# EAGLE schematic gcl (EAGLE 8.0.0)
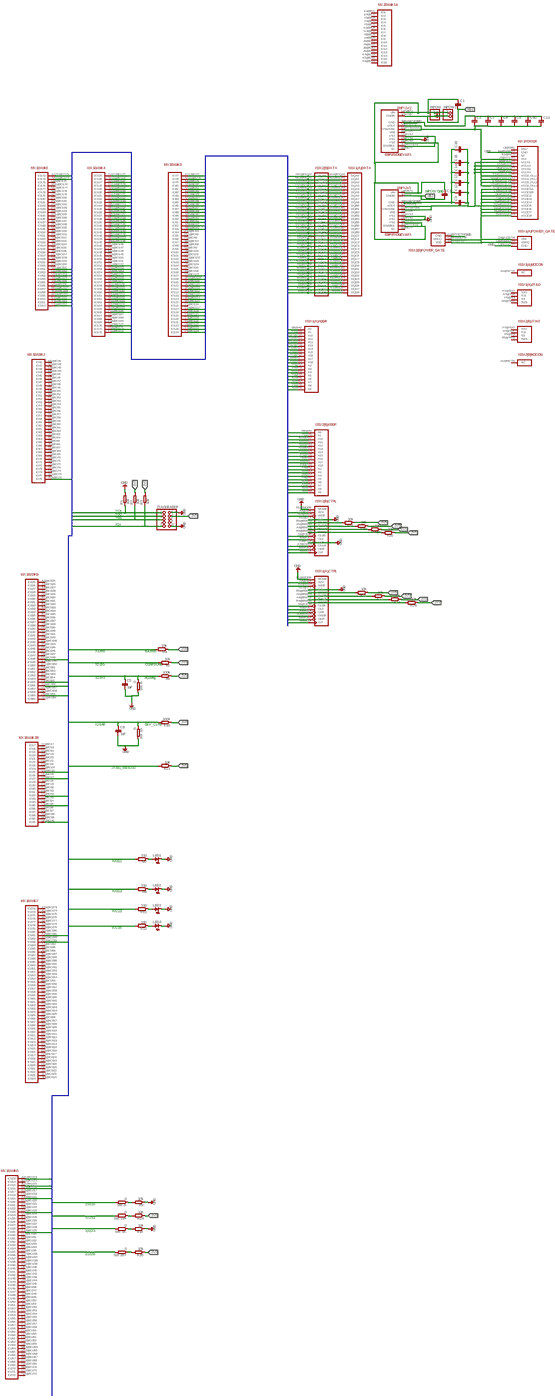
[diagram p0: schematic, sheet 1, overview]
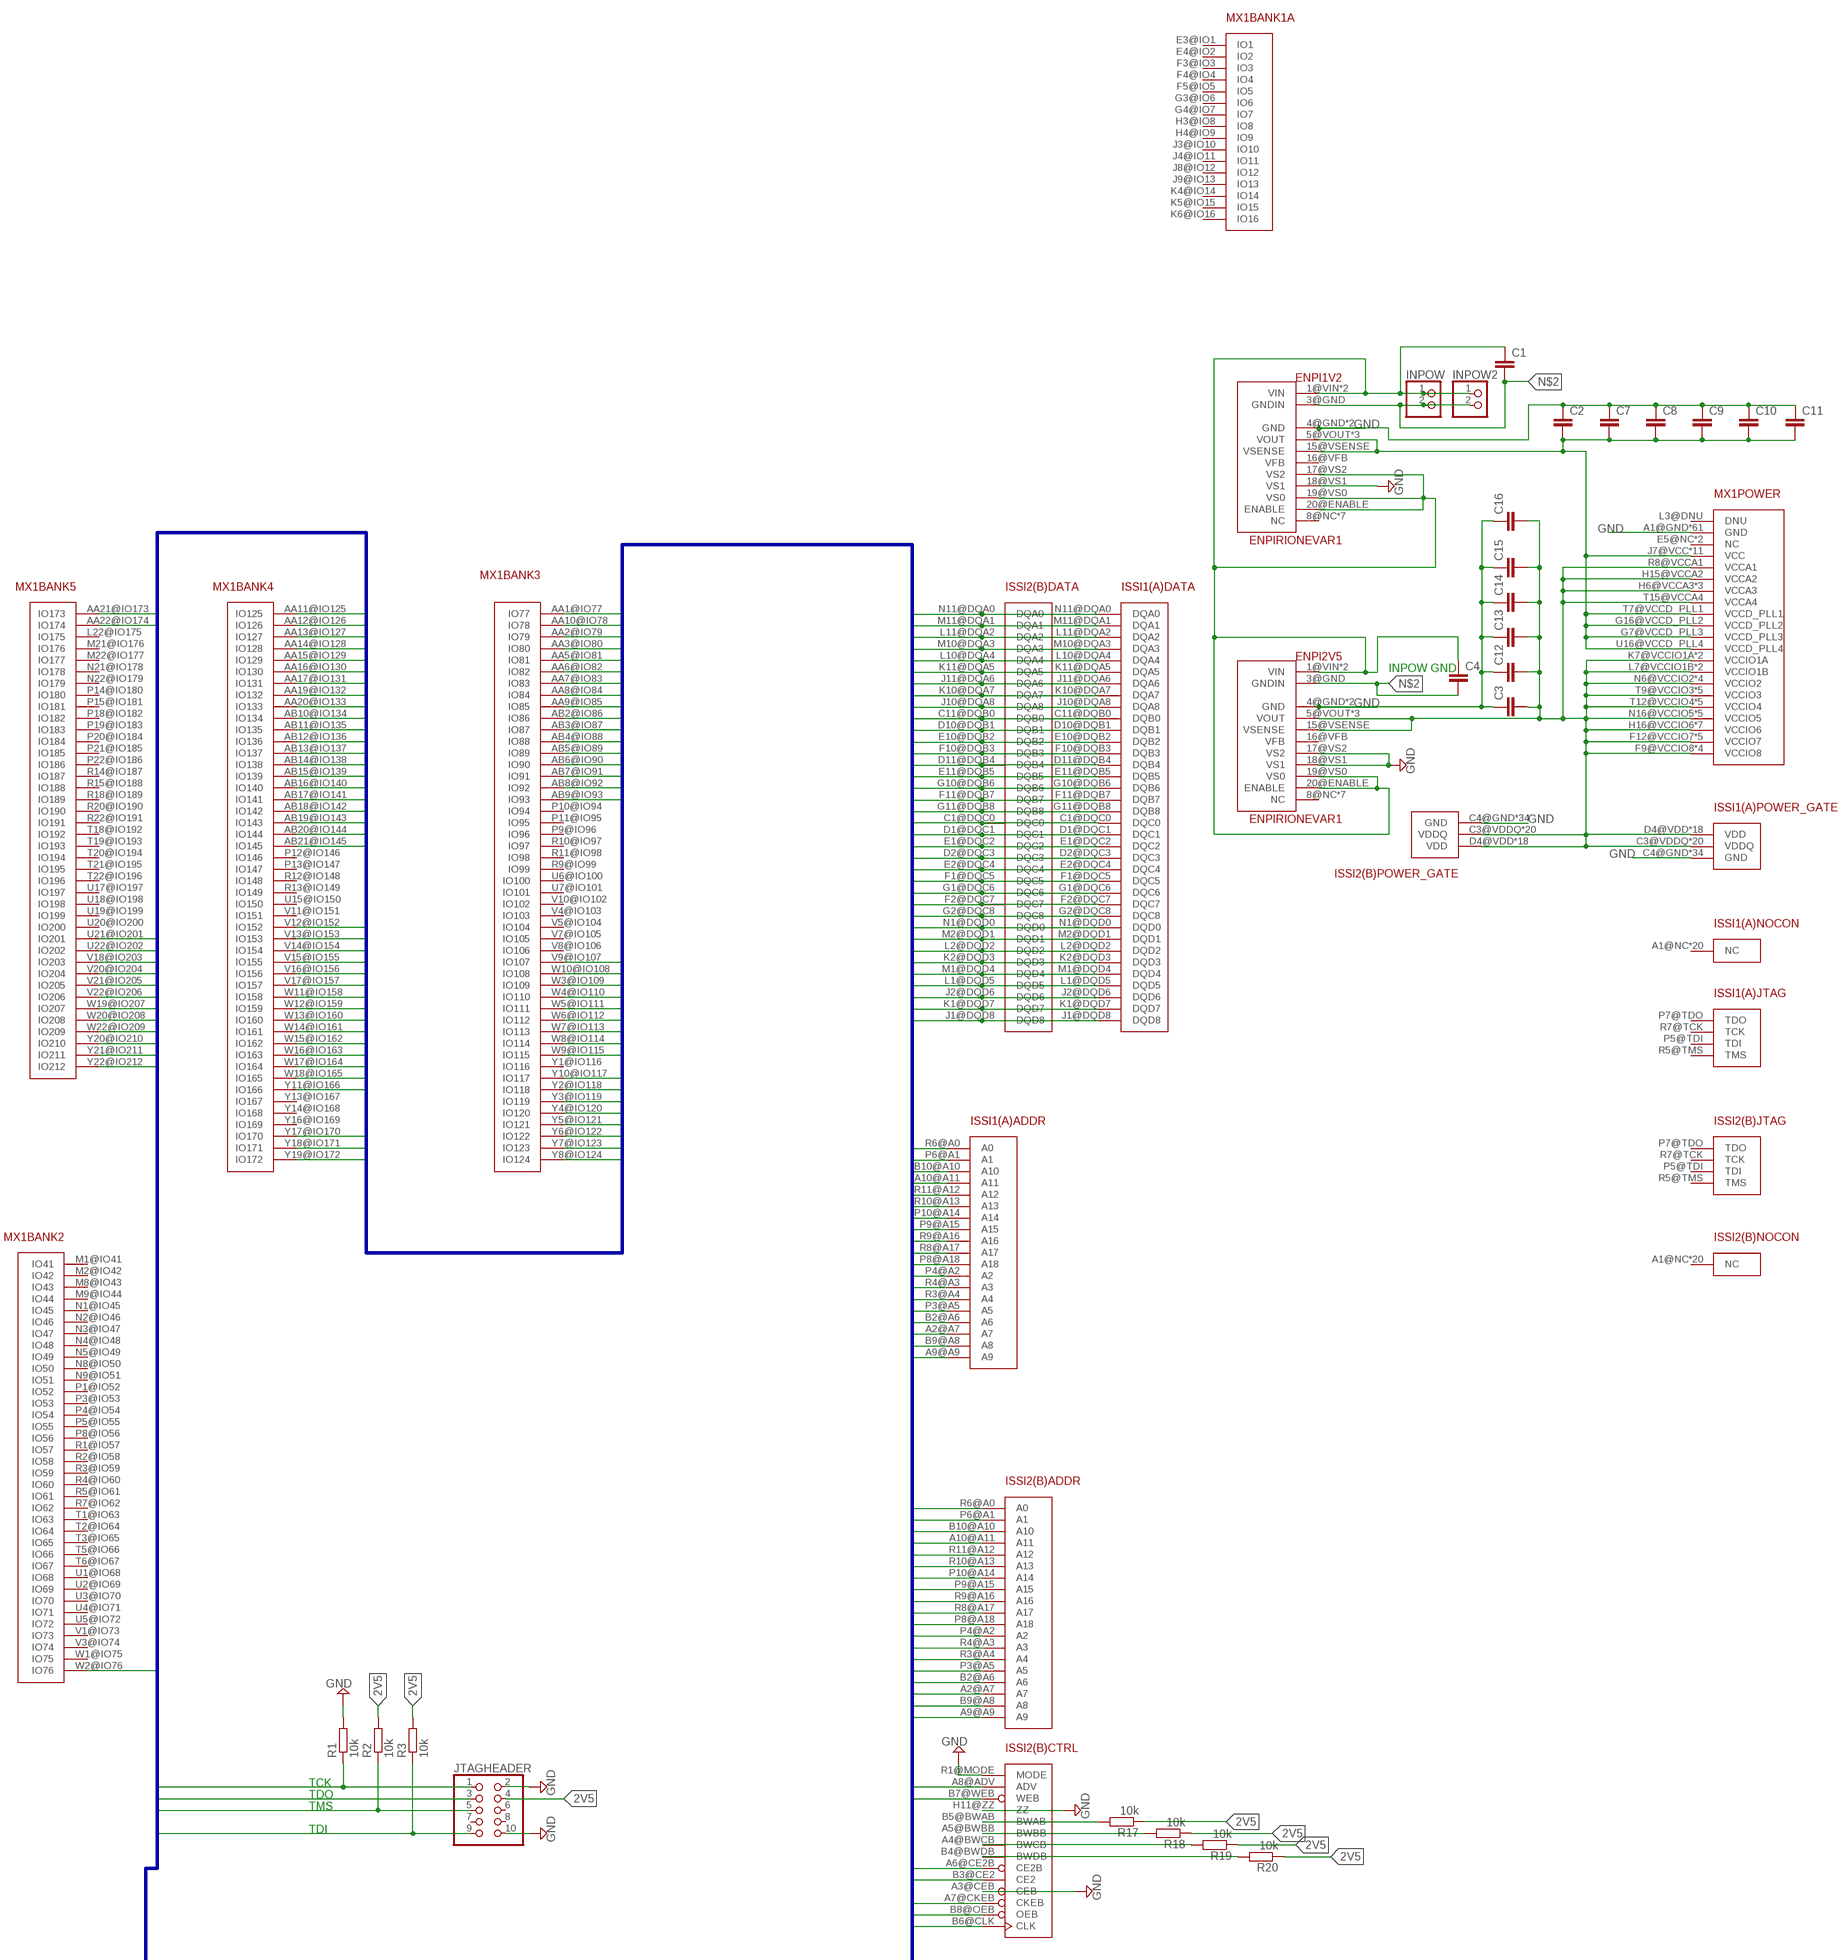
[diagram p1: schematic, sheet 1, part 1 of 4]
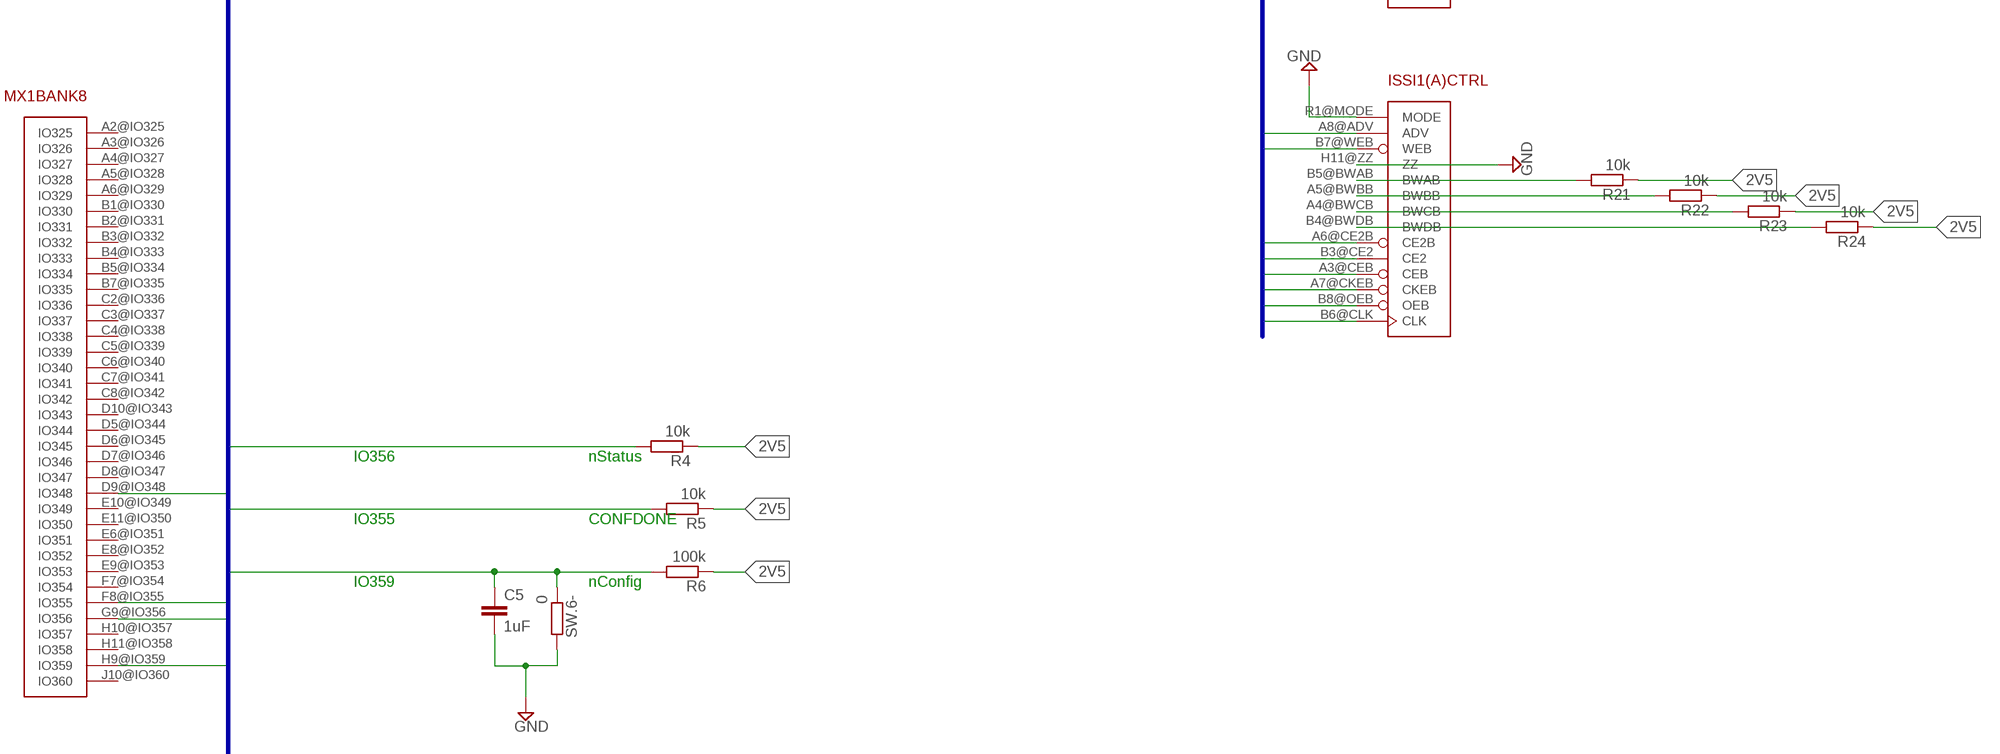
[diagram p2: schematic, sheet 1, part 2 of 4]
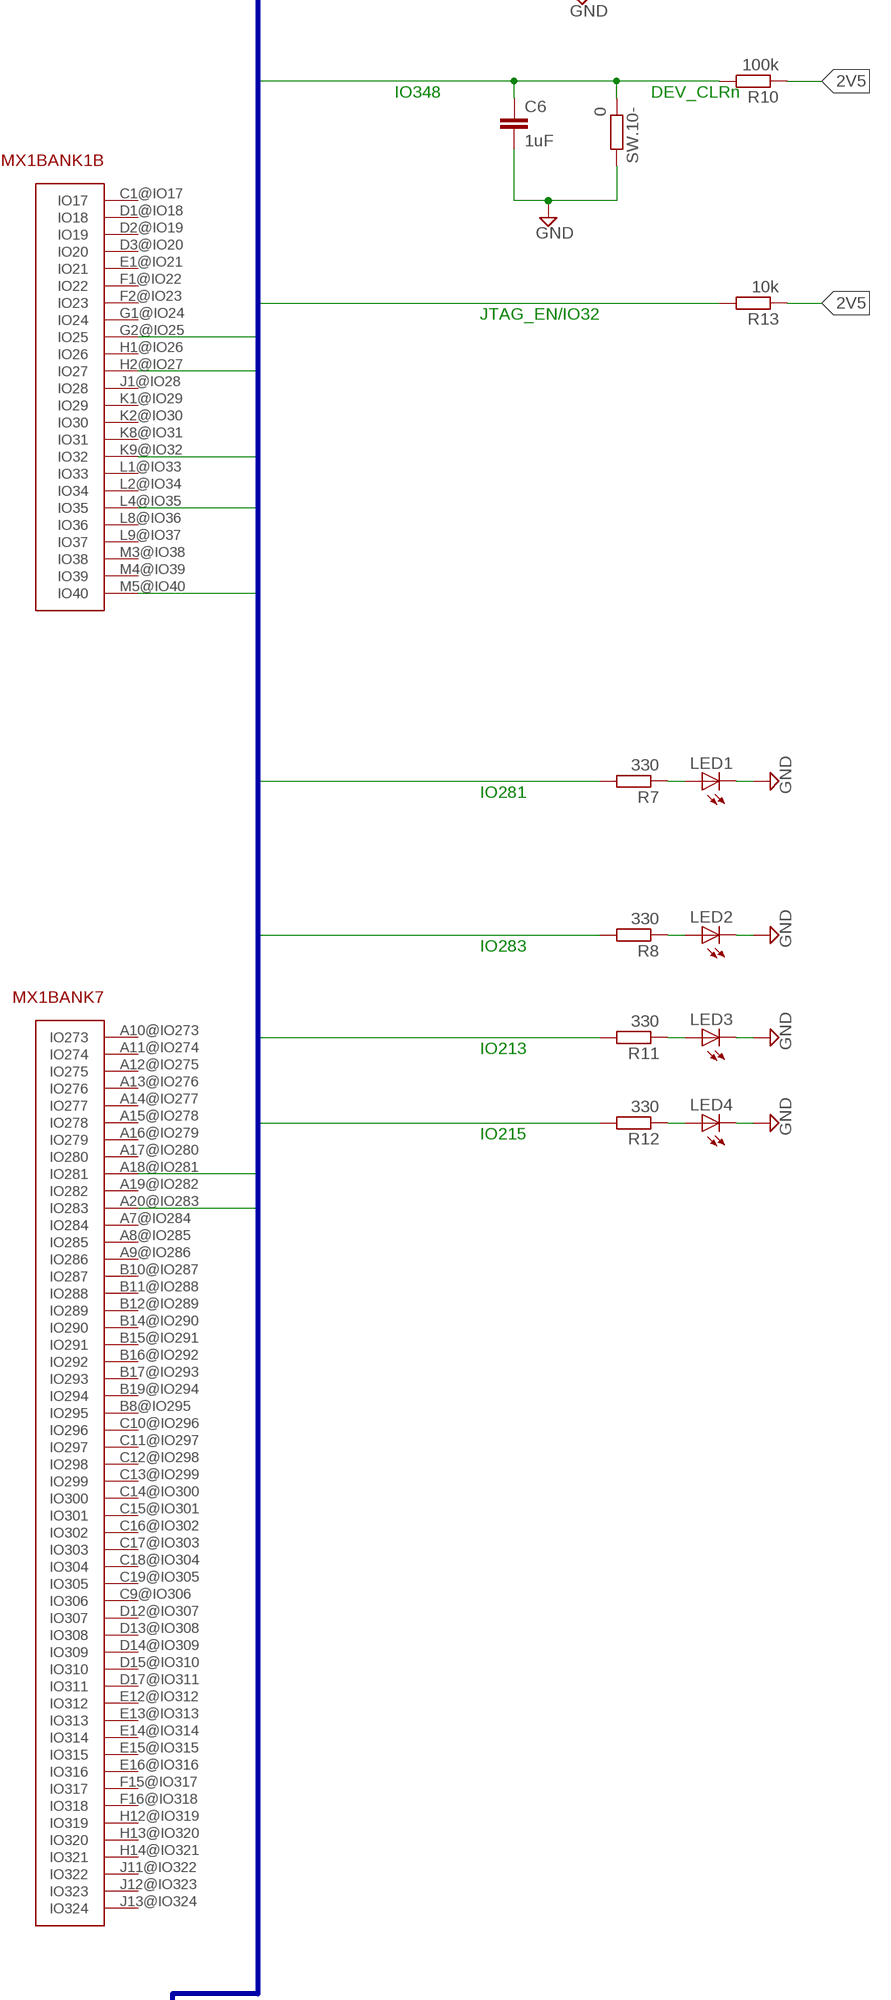
[diagram p3: schematic, sheet 1, part 3 of 4]
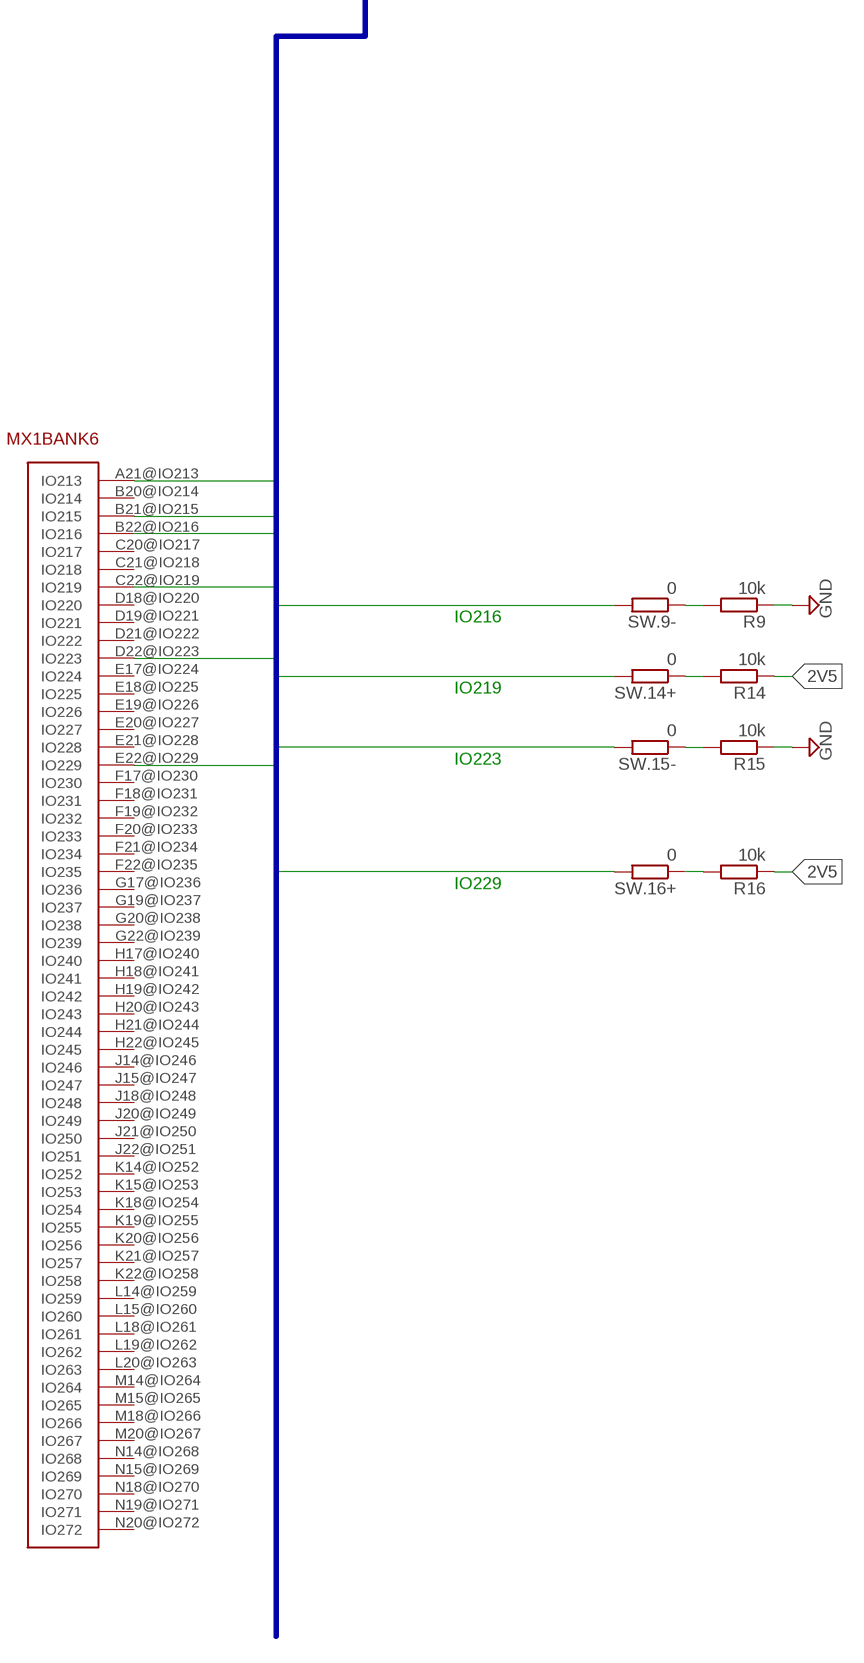
[diagram p4: schematic, sheet 1, part 4 of 4]

## Parts
C1  C-EUC0805  [C0805]
C2  C-EUC0805  [C0805]
C3  C-EUC0805  [C0805]
C4  C-EUC0805  [C0805]
C5  1uF  C-EUC0805  [C0805]
C6  1uF  C-EUC0805  [C0805]
C7  C-EUC0805  [C0805]
C8  C-EUC0805  [C0805]
C9  C-EUC0805  [C0805]
C10  C-EUC0805  [C0805]
C11  C-EUC0805  [C0805]
C12  C-EUC0805  [C0805]
C13  C-EUC0805  [C0805]
C14  C-EUC0805  [C0805]
C15  C-EUC0805  [C0805]
C16  C-EUC0805  [C0805]
ENPI1V2  ENPIRIONEVAR1  [EPAC]
ENPI2V5  ENPIRIONEVAR1  [EPAC]
INPOW  PINHD-1X2  [1X02]
INPOW2  PINHD-1X2  [1X02]
ISSI1(A)  ISSIDEVISSIVAR  [ISSI]
ISSI2(B)  ISSIDEVISSIVAR  [ISSI]
JTAGHEADER  PINHD-2X5  [2X05]
LED1  LEDSML0805  [SML0805]
LED2  LEDSML0805  [SML0805]
LED3  LEDSML0805  [SML0805]
LED4  LEDSML0805  [SML0805]
MX1  MXMXDEVICE  [MXPAC]
R1  10k  R-EU_M0805  [M0805]
R2  10k  R-EU_M0805  [M0805]
R3  10k  R-EU_M0805  [M0805]
R4  10k  R-EU_M0805  [M0805]
R5  10k  R-EU_M0805  [M0805]
R6  100k  R-EU_M0805  [M0805]
R7  330  R-EU_M0805  [M0805]
R8  330  R-EU_M0805  [M0805]
R9  10k  R-EU_M0805  [M0805]
R10  100k  R-EU_M0805  [M0805]
R11  330  R-EU_M0805  [M0805]
R12  330  R-EU_M0805  [M0805]
R13  10k  R-EU_M0805  [M0805]
R14  10k  R-EU_M0805  [M0805]
R15  10k  R-EU_M0805  [M0805]
R16  10k  R-EU_M0805  [M0805]
R17  10k  R-EU_M0805  [M0805]
R18  10k  R-EU_M0805  [M0805]
R19  10k  R-EU_M0805  [M0805]
R20  10k  R-EU_M0805  [M0805]
R21  10k  R-EU_M0805  [M0805]
R22  10k  R-EU_M0805  [M0805]
R23  10k  R-EU_M0805  [M0805]
R24  10k  R-EU_M0805  [M0805]
SW.6-  0  R-EU_M0805  [M0805]
SW.9-  0  R-EU_M0805  [M0805]
SW.10-  0  R-EU_M0805  [M0805]
SW.14+  0  R-EU_M0805  [M0805]
SW.15-  0  R-EU_M0805  [M0805]
SW.16+  0  R-EU_M0805  [M0805]

## Nets
1V2: C2.2 C7.2 C8.2 C9.2 C10.2 C11.2 ENPI1V2.5@VOUT(VOUT) ENPI1V2.6@VOUT(VOUT) ENPI1V2.7@VOUT(VOUT) ENPI1V2.15@VSENSE(VSENSE) MX1.G7@VCCD_PLL3(POWER:VCCD_PLL3) MX1.G16@VCCD_PLL2(POWER:VCCD_PLL2) MX1.J7@VCC(POWER:VCC) MX1.K11@VCC(POWER:VCC) MX1.K13@VCC(POWER:VCC) MX1.L10@VCC(POWER:VCC) MX1.L11@VCC(POWER:VCC) MX1.L12@VCC(POWER:VCC) MX1.M11@VCC(POWER:VCC) MX1.M12@VCC(POWER:VCC) MX1.M13@VCC(POWER:VCC) MX1.N10@VCC(POWER:VCC) MX1.N12@VCC(POWER:VCC) MX1.T7@VCCD_PLL1(POWER:VCCD_PLL1) MX1.U16@VCCD_PLL4(POWER:VCCD_PLL4)
2V5 [sup]: C3.2 C12.2 C13.2 C14.2 C15.2 C16.2 ENPI2V5.5@VOUT(VOUT) ENPI2V5.6@VOUT(VOUT) ENPI2V5.7@VOUT(VOUT) ENPI2V5.15@VSENSE(VSENSE) ISSI1(A).C3@VDDQ(POWER_GATE:VDDQ) ISSI1(A).C9@VDDQ(POWER_GATE:VDDQ) ISSI1(A).D3@VDDQ(POWER_GATE:VDDQ) ISSI1(A).D4@VDD(POWER_GATE:VDD) ISSI1(A).D8@VDD(POWER_GATE:VDD) ISSI1(A).D9@VDDQ(POWER_GATE:VDDQ) ISSI1(A).E3@VDDQ(POWER_GATE:VDDQ) ISSI1(A).E4@VDD(POWER_GATE:VDD) ISSI1(A).E8@VDD(POWER_GATE:VDD) ISSI1(A).E9@VDDQ(POWER_GATE:VDDQ) ISSI1(A).F3@VDDQ(POWER_GATE:VDDQ) ISSI1(A).F4@VDD(POWER_GATE:VDD) ISSI1(A).F8@VDD(POWER_GATE:VDD) ISSI1(A).F9@VDDQ(POWER_GATE:VDDQ) ISSI1(A).G3@VDDQ(POWER_GATE:VDDQ) ISSI1(A).G4@VDD(POWER_GATE:VDD) ISSI1(A).G8@VDD(POWER_GATE:VDD) ISSI1(A).G9@VDDQ(POWER_GATE:VDDQ) ISSI1(A).H4@VDD(POWER_GATE:VDD) ISSI1(A).H8@VDD(POWER_GATE:VDD) ISSI1(A).J3@VDDQ(POWER_GATE:VDDQ) ISSI1(A).J4@VDD(POWER_GATE:VDD) ISSI1(A).J8@VDD(POWER_GATE:VDD) ISSI1(A).J9@VDDQ(POWER_GATE:VDDQ) ISSI1(A).K3@VDDQ(POWER_GATE:VDDQ) ISSI1(A).K4@VDD(POWER_GATE:VDD) ISSI1(A).K8@VDD(POWER_GATE:VDD) ISSI1(A).K9@VDDQ(POWER_GATE:VDDQ) ISSI1(A).L3@VDDQ(POWER_GATE:VDDQ) ISSI1(A).L4@VDD(POWER_GATE:VDD) ISSI1(A).L8@VDD(POWER_GATE:VDD) ISSI1(A).L9@VDDQ(POWER_GATE:VDDQ) ISSI1(A).M3@VDDQ(POWER_GATE:VDDQ) ISSI1(A).M4@VDD(POWER_GATE:VDD) ISSI1(A).M8@VDD(POWER_GATE:VDD) ISSI1(A).M9@VDDQ(POWER_GATE:VDDQ) ISSI1(A).N3@VDDQ(POWER_GATE:VDDQ) ISSI1(A).N9@VDDQ(POWER_GATE:VDDQ) ISSI2(B).C3@VDDQ(POWER_GATE:VDDQ) ISSI2(B).C9@VDDQ(POWER_GATE:VDDQ) ISSI2(B).D3@VDDQ(POWER_GATE:VDDQ) ISSI2(B).D4@VDD(POWER_GATE:VDD) ISSI2(B).D8@VDD(POWER_GATE:VDD) ISSI2(B).D9@VDDQ(POWER_GATE:VDDQ) ISSI2(B).E3@VDDQ(POWER_GATE:VDDQ) ISSI2(B).E4@VDD(POWER_GATE:VDD) ISSI2(B).E8@VDD(POWER_GATE:VDD) ISSI2(B).E9@VDDQ(POWER_GATE:VDDQ) ISSI2(B).F3@VDDQ(POWER_GATE:VDDQ) ISSI2(B).F4@VDD(POWER_GATE:VDD) ISSI2(B).F8@VDD(POWER_GATE:VDD) ISSI2(B).F9@VDDQ(POWER_GATE:VDDQ) ISSI2(B).G3@VDDQ(POWER_GATE:VDDQ) ISSI2(B).G4@VDD(POWER_GATE:VDD) ISSI2(B).G8@VDD(POWER_GATE:VDD) ISSI2(B).G9@VDDQ(POWER_GATE:VDDQ) ISSI2(B).H4@VDD(POWER_GATE:VDD) ISSI2(B).H8@VDD(POWER_GATE:VDD) ISSI2(B).J3@VDDQ(POWER_GATE:VDDQ) ISSI2(B).J4@VDD(POWER_GATE:VDD) ISSI2(B).J8@VDD(POWER_GATE:VDD) ISSI2(B).J9@VDDQ(POWER_GATE:VDDQ) ISSI2(B).K3@VDDQ(POWER_GATE:VDDQ) ISSI2(B).K4@VDD(POWER_GATE:VDD) ISSI2(B).K8@VDD(POWER_GATE:VDD) ISSI2(B).K9@VDDQ(POWER_GATE:VDDQ) ISSI2(B).L3@VDDQ(POWER_GATE:VDDQ) ISSI2(B).L4@VDD(POWER_GATE:VDD) ISSI2(B).L8@VDD(POWER_GATE:VDD) ISSI2(B).L9@VDDQ(POWER_GATE:VDDQ) ISSI2(B).M3@VDDQ(POWER_GATE:VDDQ) ISSI2(B).M4@VDD(POWER_GATE:VDD) ISSI2(B).M8@VDD(POWER_GATE:VDD) ISSI2(B).M9@VDDQ(POWER_GATE:VDDQ) ISSI2(B).N3@VDDQ(POWER_GATE:VDDQ) ISSI2(B).N9@VDDQ(POWER_GATE:VDDQ) JTAGHEADER.4 MX1.F9@VCCIO8(POWER:VCCIO8) MX1.F11@VCCIO8(POWER:VCCIO8) MX1.F12@VCCIO7(POWER:VCCIO7) MX1.F14@VCCIO7(POWER:VCCIO7) MX1.G10@VCCIO8(POWER:VCCIO8) MX1.G11@VCCIO8(POWER:VCCIO8) MX1.G12@VCCIO7(POWER:VCCIO7) MX1.G13@VCCIO7(POWER:VCCIO7) MX1.G14@VCCIO7(POWER:VCCIO7) MX1.H6@VCCA3(POWER:VCCA3) MX1.H7@VCCA3(POWER:VCCA3) MX1.H8@VCCA3(POWER:VCCA3) MX1.H15@VCCA2(POWER:VCCA2) MX1.H16@VCCIO6(POWER:VCCIO6) MX1.J17@VCCIO6(POWER:VCCIO6) MX1.K7@VCCIO1A(POWER:VCCIO1A) MX1.K16@VCCIO6(POWER:VCCIO6) MX1.K17@VCCIO6(POWER:VCCIO6) MX1.L6@VCCIO1A(POWER:VCCIO1A) MX1.L7@VCCIO1B(POWER:VCCIO1B) MX1.L16@VCCIO6(POWER:VCCIO6) MX1.M6@VCCIO1B(POWER:VCCIO1B) MX1.M17@VCCIO6(POWER:VCCIO6) MX1.N6@VCCIO2(POWER:VCCIO2) MX1.N7@VCCIO2(POWER:VCCIO2) MX1.N16@VCCIO5(POWER:VCCIO5) MX1.N17@VCCIO6(POWER:VCCIO6) MX1.P7@VCCIO2(POWER:VCCIO2) MX1.P16@VCCIO5(POWER:VCCIO5) MX1.R6@VCCIO2(POWER:VCCIO2) MX1.R8@VCCA1(POWER:VCCA1) MX1.R16@VCCIO5(POWER:VCCIO5) MX1.R17@VCCIO5(POWER:VCCIO5) MX1.T9@VCCIO3(POWER:VCCIO3) MX1.T10@VCCIO3(POWER:VCCIO3) MX1.T11@VCCIO3(POWER:VCCIO3) MX1.T12@VCCIO4(POWER:VCCIO4) MX1.T13@VCCIO4(POWER:VCCIO4) MX1.T15@VCCA4(POWER:VCCA4) MX1.T17@VCCIO5(POWER:VCCIO5) MX1.U8@VCCIO3(POWER:VCCIO3) MX1.U9@VCCIO3(POWER:VCCIO3) MX1.U11@VCCIO4(POWER:VCCIO4) MX1.U12@VCCIO4(POWER:VCCIO4) MX1.U14@VCCIO4(POWER:VCCIO4) R2.2 R3.2 R4.1 R5.1 R6.1 R10.1 R13.1 R14.1 R16.1 R17.1 R18.1 R19.1 R20.1 R21.1 R22.1 R23.1 R24.1
GND: C2.1 C3.1 C5.2 C6.2 C7.1 C8.1 C9.1 C10.1 C11.1 C12.1 C13.1 C14.1 C15.1 C16.1 ENPI1V2.4@GND(GND) ENPI1V2.18@VS1(VS1) ENPI1V2.21@GND(GND) ENPI2V5.4@GND(GND) ENPI2V5.17@VS2(VS2) ENPI2V5.18@VS1(VS1) ENPI2V5.21@GND(GND) ISSI1(A).C4@GND(POWER_GATE:GND) ISSI1(A).C5@GND(POWER_GATE:GND) ISSI1(A).C6@GND(POWER_GATE:GND) ISSI1(A).C7@GND(POWER_GATE:GND) ISSI1(A).C8@GND(POWER_GATE:GND) ISSI1(A).D5@GND(POWER_GATE:GND) ISSI1(A).D6@GND(POWER_GATE:GND) ISSI1(A).D7@GND(POWER_GATE:GND) ISSI1(A).E5@GND(POWER_GATE:GND) ISSI1(A).E6@GND(POWER_GATE:GND) ISSI1(A).E7@GND(POWER_GATE:GND) ISSI1(A).F5@GND(POWER_GATE:GND) ISSI1(A).F6@GND(POWER_GATE:GND) ISSI1(A).F7@GND(POWER_GATE:GND) ISSI1(A).G5@GND(POWER_GATE:GND) ISSI1(A).G6@GND(POWER_GATE:GND) ISSI1(A).G7@GND(POWER_GATE:GND) ISSI1(A).H5@GND(POWER_GATE:GND) ISSI1(A).H6@GND(POWER_GATE:GND) ISSI1(A).H7@GND(POWER_GATE:GND) ISSI1(A).H11@ZZ(CTRL:ZZ) ISSI1(A).J5@GND(POWER_GATE:GND) ISSI1(A).J6@GND(POWER_GATE:GND) ISSI1(A).J7@GND(POWER_GATE:GND) ISSI1(A).K5@GND(POWER_GATE:GND) ISSI1(A).K6@GND(POWER_GATE:GND) ISSI1(A).K7@GND(POWER_GATE:GND) ISSI1(A).L5@GND(POWER_GATE:GND) ISSI1(A).L6@GND(POWER_GATE:GND) ISSI1(A).L7@GND(POWER_GATE:GND) ISSI1(A).M5@GND(POWER_GATE:GND) ISSI1(A).M6@GND(POWER_GATE:GND) ISSI1(A).M7@GND(POWER_GATE:GND) ISSI1(A).N4@GND(POWER_GATE:GND) ISSI1(A).N8@GND(POWER_GATE:GND) ISSI1(A).R1@MODE(CTRL:MODE) ISSI2(B).A3@CEB(CTRL:CEB) ISSI2(B).C4@GND(POWER_GATE:GND) ISSI2(B).C5@GND(POWER_GATE:GND) ISSI2(B).C6@GND(POWER_GATE:GND) ISSI2(B).C7@GND(POWER_GATE:GND) ISSI2(B).C8@GND(POWER_GATE:GND) ISSI2(B).D5@GND(POWER_GATE:GND) ISSI2(B).D6@GND(POWER_GATE:GND) ISSI2(B).D7@GND(POWER_GATE:GND) ISSI2(B).E5@GND(POWER_GATE:GND) ISSI2(B).E6@GND(POWER_GATE:GND) ISSI2(B).E7@GND(POWER_GATE:GND) ISSI2(B).F5@GND(POWER_GATE:GND) ISSI2(B).F6@GND(POWER_GATE:GND) ISSI2(B).F7@GND(POWER_GATE:GND) ISSI2(B).G5@GND(POWER_GATE:GND) ISSI2(B).G6@GND(POWER_GATE:GND) ISSI2(B).G7@GND(POWER_GATE:GND) ISSI2(B).H5@GND(POWER_GATE:GND) ISSI2(B).H6@GND(POWER_GATE:GND) ISSI2(B).H7@GND(POWER_GATE:GND) ISSI2(B).H11@ZZ(CTRL:ZZ) ISSI2(B).J5@GND(POWER_GATE:GND) ISSI2(B).J6@GND(POWER_GATE:GND) ISSI2(B).J7@GND(POWER_GATE:GND) ISSI2(B).K5@GND(POWER_GATE:GND) ISSI2(B).K6@GND(POWER_GATE:GND) ISSI2(B).K7@GND(POWER_GATE:GND) ISSI2(B).L5@GND(POWER_GATE:GND) ISSI2(B).L6@GND(POWER_GATE:GND) ISSI2(B).L7@GND(POWER_GATE:GND) ISSI2(B).M5@GND(POWER_GATE:GND) ISSI2(B).M6@GND(POWER_GATE:GND) ISSI2(B).M7@GND(POWER_GATE:GND) ISSI2(B).N4@GND(POWER_GATE:GND) ISSI2(B).N8@GND(POWER_GATE:GND) ISSI2(B).R1@MODE(CTRL:MODE) JTAGHEADER.2 JTAGHEADER.10 LED1.C LED2.C LED3.C LED4.C MX1.A1@GND(POWER:GND) MX1.A22@GND(POWER:GND) MX1.AA4@GND(POWER:GND) MX1.AA18@GND(POWER:GND) MX1.AB1@GND(POWER:GND) MX1.AB22@GND(POWER:GND) MX1.B6@GND(POWER:GND) MX1.B9@GND(POWER:GND) MX1.B13@GND(POWER:GND) MX1.B18@GND(POWER:GND) MX1.D4@GND(POWER:GND) MX1.D11@GND(POWER:GND) MX1.D16@GND(POWER:GND) MX1.D20@GND(POWER:GND) MX1.E2@GND(POWER:GND) MX1.E7@GND(POWER:GND) MX1.F10@GND(POWER:GND) MX1.F13@GND(POWER:GND) MX1.G5@GND(POWER:GND) MX1.G6@GND(POWER:GND) MX1.G8@GND(POWER:GND) MX1.G15@GND(POWER:GND) MX1.G18@GND(POWER:GND) MX1.G21@GND(POWER:GND) MX1.H5@GND(POWER:GND) MX1.J2@GND(POWER:GND) MX1.J5@GND(POWER:GND) MX1.J6@GND(POWER:GND) MX1.J16@GND(POWER:GND) MX1.J19@GND(POWER:GND) MX1.K3@GND(POWER:GND) MX1.K10@GND(POWER:GND) MX1.K12@GND(POWER:GND) MX1.L5@GND(POWER:GND) MX1.L13@GND(POWER:GND) MX1.L17@GND(POWER:GND) MX1.L21@GND(POWER:GND) MX1.M7@GND(POWER:GND) MX1.M10@GND(POWER:GND) MX1.M16@GND(POWER:GND) MX1.M19@GND(POWER:GND) MX1.N11@GND(POWER:GND) MX1.N13@GND(POWER:GND) MX1.P2@GND(POWER:GND) MX1.P6@GND(POWER:GND) MX1.P17@GND(POWER:GND) MX1.R19@GND(POWER:GND) MX1.R21@GND(POWER:GND) MX1.T4@GND(POWER:GND) MX1.T8@GND(POWER:GND) MX1.T14@GND(POWER:GND) MX1.T16@GND(POWER:GND) MX1.U10@GND(POWER:GND) MX1.U13@GND(POWER:GND) MX1.V2@GND(POWER:GND) MX1.V6@GND(POWER:GND) MX1.V19@GND(POWER:GND) MX1.W21@GND(POWER:GND) MX1.Y9@GND(POWER:GND) MX1.Y12@GND(POWER:GND) MX1.Y15@GND(POWER:GND) R1.2 R9.1 R15.1 SW.6-.2 SW.10-.2
IO25: JTAGHEADER.1 MX1.G2@IO25(BANK1B:IO25) R1.1
IO27: JTAGHEADER.5 MX1.H2@IO27(BANK1B:IO27) R2.1
IO32: MX1.K9@IO32(BANK1B:IO32) R13.2
IO35: JTAGHEADER.9 MX1.L4@IO35(BANK1B:IO35) R3.1
IO40: JTAGHEADER.3 MX1.M5@IO40(BANK1B:IO40)
IO76: ISSI2(B).A7@CKEB(CTRL:CKEB) MX1.W2@IO76(BANK2:IO76)
IO77: ISSI2(B).B7@WEB(CTRL:WEB) MX1.AA1@IO77(BANK3:IO77)
IO78: ISSI1(A).E2@DQC4(DATA:DQC4) ISSI2(B).E2@DQC4(DATA:DQC4) MX1.AA10@IO78(BANK3:IO78)
IO79: ISSI1(A).A3@CEB(CTRL:CEB) MX1.AA2@IO79(BANK3:IO79)
IO80: ISSI1(A).A10@A11(ADDR:A11) MX1.AA3@IO80(BANK3:IO80)
IO81: ISSI1(A).B2@A6(ADDR:A6) MX1.AA5@IO81(BANK3:IO81)
IO82: ISSI1(A).B8@OEB(CTRL:OEB) MX1.AA6@IO82(BANK3:IO82)
IO83: ISSI2(B).B10@A10(ADDR:A10) MX1.AA7@IO83(BANK3:IO83)
IO84: ISSI2(B).B2@A6(ADDR:A6) MX1.AA8@IO84(BANK3:IO84)
IO85: ISSI1(A).D2@DQC3(DATA:DQC3) ISSI2(B).D2@DQC3(DATA:DQC3) MX1.AA9@IO85(BANK3:IO85)
IO86: ISSI1(A).A2@A7(ADDR:A7) MX1.AB2@IO86(BANK3:IO86)
IO87: ISSI1(A).A7@CKEB(CTRL:CKEB) MX1.AB3@IO87(BANK3:IO87)
IO88: ISSI2(B).B8@OEB(CTRL:OEB) MX1.AB4@IO88(BANK3:IO88)
IO89: ISSI1(A).A6@CE2B(CTRL:CE2B) MX1.AB5@IO89(BANK3:IO89)
IO90: ISSI1(A).B7@WEB(CTRL:WEB) MX1.AB6@IO90(BANK3:IO90)
IO91: ISSI2(B).A10@A11(ADDR:A11) MX1.AB7@IO91(BANK3:IO91)
IO92: ISSI1(A).C1@DQC0(DATA:DQC0) ISSI2(B).C1@DQC0(DATA:DQC0) MX1.AB8@IO92(BANK3:IO92)
IO93: ISSI1(A).D1@DQC1(DATA:DQC1) ISSI2(B).D1@DQC1(DATA:DQC1) MX1.AB9@IO93(BANK3:IO93)
IO107: ISSI1(A).D11@DQB4(DATA:DQB4) ISSI2(B).D11@DQB4(DATA:DQB4) MX1.V9@IO107(BANK3:IO107)
IO108: ISSI1(A).E11@DQB5(DATA:DQB5) ISSI2(B).E11@DQB5(DATA:DQB5) MX1.W10@IO108(BANK3:IO108)
IO109: ISSI1(A).A8@ADV(CTRL:ADV) MX1.W3@IO109(BANK3:IO109)
IO110: ISSI2(B).A6@CE2B(CTRL:CE2B) MX1.W4@IO110(BANK3:IO110)
IO111: ISSI1(A).B6@CLK(CTRL:CLK) ISSI2(B).B6@CLK(CTRL:CLK) MX1.W5@IO111(BANK3:IO111)
IO112: ISSI1(A).B10@A10(ADDR:A10) MX1.W6@IO112(BANK3:IO112)
IO113: ISSI2(B).B9@A8(ADDR:A8) MX1.W7@IO113(BANK3:IO113)
IO114: ISSI1(A).C11@DQB0(DATA:DQB0) ISSI2(B).C11@DQB0(DATA:DQB0) MX1.W8@IO114(BANK3:IO114)
IO115: ISSI1(A).D10@DQB1(DATA:DQB1) ISSI2(B).D10@DQB1(DATA:DQB1) MX1.W9@IO115(BANK3:IO115)
IO117: ISSI1(A).E10@DQB2(DATA:DQB2) ISSI2(B).E10@DQB2(DATA:DQB2) MX1.Y10@IO117(BANK3:IO117)
IO118: ISSI2(B).A8@ADV(CTRL:ADV) MX1.Y2@IO118(BANK3:IO118)
IO119: ISSI1(A).A9@A9(ADDR:A9) MX1.Y3@IO119(BANK3:IO119)
IO120: ISSI2(B).B3@CE2(CTRL:CE2) MX1.Y4@IO120(BANK3:IO120)
IO121: ISSI1(A).B3@CE2(CTRL:CE2) MX1.Y5@IO121(BANK3:IO121)
IO122: ISSI1(A).B9@A8(ADDR:A8) MX1.Y6@IO122(BANK3:IO122)
IO123: ISSI2(B).A9@A9(ADDR:A9) MX1.Y7@IO123(BANK3:IO123)
IO124: ISSI2(B).A2@A7(ADDR:A7) MX1.Y8@IO124(BANK3:IO124)
IO125: ISSI1(A).F2@DQC7(DATA:DQC7) ISSI2(B).F2@DQC7(DATA:DQC7) MX1.AA11@IO125(BANK4:IO125)
IO126: ISSI1(A).G2@DQC8(DATA:DQC8) ISSI2(B).G2@DQC8(DATA:DQC8) MX1.AA12@IO126(BANK4:IO126)
IO127: ISSI1(A).J2@DQD6(DATA:DQD6) ISSI2(B).J2@DQD6(DATA:DQD6) MX1.AA13@IO127(BANK4:IO127)
IO128: ISSI1(A).K2@DQD3(DATA:DQD3) ISSI2(B).K2@DQD3(DATA:DQD3) MX1.AA14@IO128(BANK4:IO128)
IO129: ISSI1(A).L2@DQD2(DATA:DQD2) ISSI2(B).L2@DQD2(DATA:DQD2) MX1.AA15@IO129(BANK4:IO129)
IO130: ISSI1(A).M2@DQD1(DATA:DQD1) ISSI2(B).M2@DQD1(DATA:DQD1) MX1.AA16@IO130(BANK4:IO130)
IO131: ISSI2(B).P3@A5(ADDR:A5) MX1.AA17@IO131(BANK4:IO131)
IO132: ISSI2(B).R10@A13(ADDR:A13) MX1.AA19@IO132(BANK4:IO132)
IO133: ISSI2(B).R9@A16(ADDR:A16) MX1.AA20@IO133(BANK4:IO133)
IO134: ISSI1(A).E1@DQC2(DATA:DQC2) ISSI2(B).E1@DQC2(DATA:DQC2) MX1.AB10@IO134(BANK4:IO134)
IO135: ISSI1(A).F1@DQC5(DATA:DQC5) ISSI2(B).F1@DQC5(DATA:DQC5) MX1.AB11@IO135(BANK4:IO135)
IO136: ISSI1(A).G1@DQC6(DATA:DQC6) ISSI2(B).G1@DQC6(DATA:DQC6) MX1.AB12@IO136(BANK4:IO136)
IO137: ISSI1(A).J1@DQD8(DATA:DQD8) ISSI2(B).J1@DQD8(DATA:DQD8) MX1.AB13@IO137(BANK4:IO137)
IO138: ISSI1(A).K1@DQD7(DATA:DQD7) ISSI2(B).K1@DQD7(DATA:DQD7) MX1.AB14@IO138(BANK4:IO138)
IO139: ISSI1(A).L1@DQD5(DATA:DQD5) ISSI2(B).L1@DQD5(DATA:DQD5) MX1.AB15@IO139(BANK4:IO139)
IO140: ISSI1(A).M1@DQD4(DATA:DQD4) ISSI2(B).M1@DQD4(DATA:DQD4) MX1.AB16@IO140(BANK4:IO140)
IO141: ISSI1(A).N1@DQD0(DATA:DQD0) ISSI2(B).N1@DQD0(DATA:DQD0) MX1.AB17@IO141(BANK4:IO141)
IO142: ISSI2(B).R4@A3(ADDR:A3) MX1.AB18@IO142(BANK4:IO142)
IO143: ISSI2(B).R11@A12(ADDR:A12) MX1.AB19@IO143(BANK4:IO143)
IO144: ISSI2(B).R8@A17(ADDR:A17) MX1.AB20@IO144(BANK4:IO144)
IO145: ISSI1(A).P10@A14(ADDR:A14) MX1.AB21@IO145(BANK4:IO145)
IO152: ISSI1(A).G11@DQB8(DATA:DQB8) ISSI2(B).G11@DQB8(DATA:DQB8) MX1.V12@IO152(BANK4:IO152)
IO153: ISSI1(A).J11@DQA6(DATA:DQA6) ISSI2(B).J11@DQA6(DATA:DQA6) MX1.V13@IO153(BANK4:IO153)
IO154: ISSI1(A).K11@DQA5(DATA:DQA5) ISSI2(B).K11@DQA5(DATA:DQA5) MX1.V14@IO154(BANK4:IO154)
IO155: ISSI1(A).L11@DQA2(DATA:DQA2) ISSI2(B).L11@DQA2(DATA:DQA2) MX1.V15@IO155(BANK4:IO155)
IO156: ISSI1(A).M11@DQA1(DATA:DQA1) ISSI2(B).M11@DQA1(DATA:DQA1) MX1.V16@IO156(BANK4:IO156)
IO157: ISSI1(A).N11@DQA0(DATA:DQA0) ISSI2(B).N11@DQA0(DATA:DQA0) MX1.V17@IO157(BANK4:IO157)
IO158: ISSI1(A).F11@DQB7(DATA:DQB7) ISSI2(B).F11@DQB7(DATA:DQB7) MX1.W11@IO158(BANK4:IO158)
IO159: ISSI1(A).G10@DQB6(DATA:DQB6) ISSI2(B).G10@DQB6(DATA:DQB6) MX1.W12@IO159(BANK4:IO159)
IO160: ISSI1(A).J10@DQA8(DATA:DQA8) ISSI2(B).J10@DQA8(DATA:DQA8) MX1.W13@IO160(BANK4:IO160)
IO161: ISSI1(A).K10@DQA7(DATA:DQA7) ISSI2(B).K10@DQA7(DATA:DQA7) MX1.W14@IO161(BANK4:IO161)
IO162: ISSI1(A).L10@DQA4(DATA:DQA4) ISSI2(B).L10@DQA4(DATA:DQA4) MX1.W15@IO162(BANK4:IO162)
IO163: ISSI1(A).M10@DQA3(DATA:DQA3) ISSI2(B).M10@DQA3(DATA:DQA3) MX1.W16@IO163(BANK4:IO163)
IO164: ISSI2(B).R3@A4(ADDR:A4) MX1.W17@IO164(BANK4:IO164)
IO165: ISSI2(B).R6@A0(ADDR:A0) MX1.W18@IO165(BANK4:IO165)
IO166: ISSI1(A).F10@DQB3(DATA:DQB3) ISSI2(B).F10@DQB3(DATA:DQB3) MX1.Y11@IO166(BANK4:IO166)
IO170: ISSI2(B).P4@A2(ADDR:A2) MX1.Y17@IO170(BANK4:IO170)
IO171: ISSI2(B).P6@A1(ADDR:A1) MX1.Y18@IO171(BANK4:IO171)
IO172: ISSI2(B).P9@A15(ADDR:A15) MX1.Y19@IO172(BANK4:IO172)
IO173: ISSI1(A).R11@A12(ADDR:A12) MX1.AA21@IO173(BANK5:IO173)
IO174: ISSI1(A).P6@A1(ADDR:A1) MX1.AA22@IO174(BANK5:IO174)
IO201: ISSI1(A).P3@A5(ADDR:A5) MX1.U21@IO201(BANK5:IO201)
IO202: ISSI1(A).R3@A4(ADDR:A4) MX1.U22@IO202(BANK5:IO202)
IO203: ISSI2(B).P8@A18(ADDR:A18) MX1.V18@IO203(BANK5:IO203)
IO204: ISSI1(A).P8@A18(ADDR:A18) MX1.V20@IO204(BANK5:IO204)
IO205: ISSI1(A).R8@A17(ADDR:A17) MX1.V21@IO205(BANK5:IO205)
IO206: ISSI1(A).P4@A2(ADDR:A2) MX1.V22@IO206(BANK5:IO206)
IO207: ISSI2(B).P10@A14(ADDR:A14) MX1.W19@IO207(BANK5:IO207)
IO208: ISSI1(A).R9@A16(ADDR:A16) MX1.W20@IO208(BANK5:IO208)
IO209: ISSI1(A).R4@A3(ADDR:A3) MX1.W22@IO209(BANK5:IO209)
IO210: ISSI1(A).R10@A13(ADDR:A13) MX1.Y20@IO210(BANK5:IO210)
IO211: ISSI1(A).P9@A15(ADDR:A15) MX1.Y21@IO211(BANK5:IO211)
IO212: ISSI1(A).R6@A0(ADDR:A0) MX1.Y22@IO212(BANK5:IO212)
IO213: MX1.A21@IO213(BANK6:IO213) R11.2
IO215: MX1.B21@IO215(BANK6:IO215) R12.2
IO216: MX1.B22@IO216(BANK6:IO216) SW.9-.2
IO219: MX1.C22@IO219(BANK6:IO219) SW.14+.2
IO223: MX1.D22@IO223(BANK6:IO223) SW.15-.2
IO229: MX1.E22@IO229(BANK6:IO229) SW.16+.2
IO281: MX1.A18@IO281(BANK7:IO281) R7.2
IO283: MX1.A20@IO283(BANK7:IO283) R8.2
IO348: C6.1 MX1.D9@IO348(BANK8:IO348) R10.2 SW.10-.1
IO355: MX1.F8@IO355(BANK8:IO355) R5.2
IO356: MX1.G9@IO356(BANK8:IO356) R4.2
IO359: C5.1 MX1.H9@IO359(BANK8:IO359) R6.2 SW.6-.1
N$1: LED1.A R7.1
N$2 [sup]: C1.2 C4.2 ENPI1V2.3@GND(GNDIN) ENPI2V5.3@GND(GNDIN) INPOW2.2 INPOW.2
N$3: LED3.A R11.1
N$4: LED2.A R8.1
N$5: R9.2 SW.9-.1
N$6: LED4.A R12.1
N$7: R14.2 SW.14+.1
N$8 [sup]: ISSI2(B).B5@BWAB(CTRL:BWAB) R17.2
N$9: R16.2 SW.16+.1
N$10: R15.2 SW.15-.1
N$11 [sup]: ISSI1(A).B5@BWAB(CTRL:BWAB) R21.2
N$12 [sup]: ISSI2(B).A5@BWBB(CTRL:BWBB) R18.2
N$13 [sup]: ISSI2(B).A4@BWCB(CTRL:BWCB) R19.2
N$14 [sup]: ISSI1(A).A5@BWBB(CTRL:BWBB) R22.2
N$15 [sup]: ISSI1(A).B4@BWDB(CTRL:BWDB) R24.2
N$16 [sup]: ISSI2(B).B4@BWDB(CTRL:BWDB) R20.2
N$17 [sup]: ISSI1(A).A4@BWCB(CTRL:BWCB) R23.2
VIN [sup]: C1.1 C4.1 ENPI1V2.1@VIN(VIN) ENPI1V2.2@VIN(VIN) ENPI1V2.17@VS2(VS2) ENPI1V2.19@VS0(VS0) ENPI1V2.20@ENABLE(ENABLE) ENPI2V5.1@VIN(VIN) ENPI2V5.2@VIN(VIN) ENPI2V5.19@VS0(VS0) ENPI2V5.20@ENABLE(ENABLE) INPOW2.1 INPOW.1
Unconnected: ENPI1V2.8@NC(NC) ENPI1V2.9@NC(NC) ENPI1V2.10@NC(NC) ENPI1V2.11@NC(NC) ENPI1V2.12@NC(NC) ENPI1V2.13@NC(NC) ENPI1V2.14@NC(NC) ENPI1V2.16@VFB(VFB) ENPI2V5.8@NC(NC) ENPI2V5.9@NC(NC) ENPI2V5.10@NC(NC) ENPI2V5.11@NC(NC) ENPI2V5.12@NC(NC) ENPI2V5.13@NC(NC) ENPI2V5.14@NC(NC) ENPI2V5.16@VFB(VFB) ISSI1(A).A1@NC(NOCON:NC) ISSI1(A).A11@NC(NOCON:NC) ISSI1(A).B1@NC(NOCON:NC) ISSI1(A).B11@NC(NOCON:NC) ISSI1(A).C2@NC(NOCON:NC) ISSI1(A).C10@NC(NOCON:NC) ISSI1(A).H1@NC(NOCON:NC) ISSI1(A).H2@NC(NOCON:NC) ISSI1(A).H3@NC(NOCON:NC) ISSI1(A).H9@NC(NOCON:NC) ISSI1(A).H10@NC(NOCON:NC) ISSI1(A).N2@NC(NOCON:NC) ISSI1(A).N5@NC(NOCON:NC) ISSI1(A).N6@NC(NOCON:NC) ISSI1(A).N7@NC(NOCON:NC) ISSI1(A).N10@NC(NOCON:NC) ISSI1(A).P1@NC(NOCON:NC) ISSI1(A).P2@NC(NOCON:NC) ISSI1(A).P5@TDI(JTAG:TDI) ISSI1(A).P7@TDO(JTAG:TDO) ISSI1(A).P11@NC(NOCON:NC) ISSI1(A).R2@NC(NOCON:NC) ISSI1(A).R5@TMS(JTAG:TMS) ISSI1(A).R7@TCK(JTAG:TCK) ISSI2(B).A1@NC(NOCON:NC) ISSI2(B).A11@NC(NOCON:NC) ISSI2(B).B1@NC(NOCON:NC) ISSI2(B).B11@NC(NOCON:NC) ISSI2(B).C2@NC(NOCON:NC) ISSI2(B).C10@NC(NOCON:NC) ISSI2(B).H1@NC(NOCON:NC) ISSI2(B).H2@NC(NOCON:NC) ISSI2(B).H3@NC(NOCON:NC) ISSI2(B).H9@NC(NOCON:NC) ISSI2(B).H10@NC(NOCON:NC) ISSI2(B).N2@NC(NOCON:NC) ISSI2(B).N5@NC(NOCON:NC) ISSI2(B).N6@NC(NOCON:NC) ISSI2(B).N7@NC(NOCON:NC) ISSI2(B).N10@NC(NOCON:NC) ISSI2(B).P1@NC(NOCON:NC) ISSI2(B).P2@NC(NOCON:NC) ISSI2(B).P5@TDI(JTAG:TDI) ISSI2(B).P7@TDO(JTAG:TDO) ISSI2(B).P11@NC(NOCON:NC) ISSI2(B).R2@NC(NOCON:NC) ISSI2(B).R5@TMS(JTAG:TMS) ISSI2(B).R7@TCK(JTAG:TCK) JTAGHEADER.6 JTAGHEADER.7 JTAGHEADER.8 MX1.A2@IO325(BANK8:IO325) MX1.A3@IO326(BANK8:IO326) MX1.A4@IO327(BANK8:IO327) MX1.A5@IO328(BANK8:IO328) MX1.A6@IO329(BANK8:IO329) MX1.A7@IO284(BANK7:IO284) MX1.A8@IO285(BANK7:IO285) MX1.A9@IO286(BANK7:IO286) MX1.A10@IO273(BANK7:IO273) MX1.A11@IO274(BANK7:IO274) MX1.A12@IO275(BANK7:IO275) MX1.A13@IO276(BANK7:IO276) MX1.A14@IO277(BANK7:IO277) MX1.A15@IO278(BANK7:IO278) MX1.A16@IO279(BANK7:IO279) MX1.A17@IO280(BANK7:IO280) MX1.A19@IO282(BANK7:IO282) MX1.B1@IO330(BANK8:IO330) MX1.B2@IO331(BANK8:IO331) MX1.B3@IO332(BANK8:IO332) MX1.B4@IO333(BANK8:IO333) MX1.B5@IO334(BANK8:IO334) MX1.B7@IO335(BANK8:IO335) MX1.B8@IO295(BANK7:IO295) MX1.B10@IO287(BANK7:IO287) MX1.B11@IO288(BANK7:IO288) MX1.B12@IO289(BANK7:IO289) MX1.B14@IO290(BANK7:IO290) MX1.B15@IO291(BANK7:IO291) MX1.B16@IO292(BANK7:IO292) MX1.B17@IO293(BANK7:IO293) MX1.B19@IO294(BANK7:IO294) MX1.B20@IO214(BANK6:IO214) MX1.C1@IO17(BANK1B:IO17) MX1.C2@IO336(BANK8:IO336) MX1.C3@IO337(BANK8:IO337) MX1.C4@IO338(BANK8:IO338) MX1.C5@IO339(BANK8:IO339) MX1.C6@IO340(BANK8:IO340) MX1.C7@IO341(BANK8:IO341) MX1.C8@IO342(BANK8:IO342) MX1.C9@IO306(BANK7:IO306) MX1.C10@IO296(BANK7:IO296) MX1.C11@IO297(BANK7:IO297) MX1.C12@IO298(BANK7:IO298) MX1.C13@IO299(BANK7:IO299) MX1.C14@IO300(BANK7:IO300) MX1.C15@IO301(BANK7:IO301) MX1.C16@IO302(BANK7:IO302) MX1.C17@IO303(BANK7:IO303) MX1.C18@IO304(BANK7:IO304) MX1.C19@IO305(BANK7:IO305) MX1.C20@IO217(BANK6:IO217) MX1.C21@IO218(BANK6:IO218) MX1.D1@IO18(BANK1B:IO18) MX1.D2@IO19(BANK1B:IO19) MX1.D3@IO20(BANK1B:IO20) MX1.D5@IO344(BANK8:IO344) MX1.D6@IO345(BANK8:IO345) MX1.D7@IO346(BANK8:IO346) MX1.D8@IO347(BANK8:IO347) MX1.D10@IO343(BANK8:IO343) MX1.D12@IO307(BANK7:IO307) MX1.D13@IO308(BANK7:IO308) MX1.D14@IO309(BANK7:IO309) MX1.D15@IO310(BANK7:IO310) MX1.D17@IO311(BANK7:IO311) MX1.D18@IO220(BANK6:IO220) MX1.D19@IO221(BANK6:IO221) MX1.D21@IO222(BANK6:IO222) MX1.E1@IO21(BANK1B:IO21) MX1.E3@IO1(BANK1A:IO1) MX1.E4@IO2(BANK1A:IO2) MX1.E5@NC(POWER:NC) MX1.E6@IO351(BANK8:IO351) MX1.E8@IO352(BANK8:IO352) MX1.E9@IO353(BANK8:IO353) MX1.E10@IO349(BANK8:IO349) MX1.E11@IO350(BANK8:IO350) MX1.E12@IO312(BANK7:IO312) MX1.E13@IO313(BANK7:IO313) MX1.E14@IO314(BANK7:IO314) MX1.E15@IO315(BANK7:IO315) MX1.E16@IO316(BANK7:IO316) MX1.E17@IO224(BANK6:IO224) MX1.E18@IO225(BANK6:IO225) MX1.E19@IO226(BANK6:IO226) MX1.E20@IO227(BANK6:IO227) MX1.E21@IO228(BANK6:IO228) MX1.F1@IO22(BANK1B:IO22) MX1.F2@IO23(BANK1B:IO23) MX1.F3@IO3(BANK1A:IO3) MX1.F4@IO4(BANK1A:IO4) MX1.F5@IO5(BANK1A:IO5) MX1.F6@NC(POWER:NC) MX1.F7@IO354(BANK8:IO354) MX1.F15@IO317(BANK7:IO317) MX1.F16@IO318(BANK7:IO318) MX1.F17@IO230(BANK6:IO230) MX1.F18@IO231(BANK6:IO231) MX1.F19@IO232(BANK6:IO232) MX1.F20@IO233(BANK6:IO233) MX1.F21@IO234(BANK6:IO234) MX1.F22@IO235(BANK6:IO235) MX1.G1@IO24(BANK1B:IO24) MX1.G3@IO6(BANK1A:IO6) MX1.G4@IO7(BANK1A:IO7) MX1.G17@IO236(BANK6:IO236) MX1.G19@IO237(BANK6:IO237) MX1.G20@IO238(BANK6:IO238) MX1.G22@IO239(BANK6:IO239) MX1.H1@IO26(BANK1B:IO26) MX1.H3@IO8(BANK1A:IO8) MX1.H4@IO9(BANK1A:IO9) MX1.H10@IO357(BANK8:IO357) MX1.H11@IO358(BANK8:IO358) MX1.H12@IO319(BANK7:IO319) MX1.H13@IO320(BANK7:IO320) MX1.H14@IO321(BANK7:IO321) MX1.H17@IO240(BANK6:IO240) MX1.H18@IO241(BANK6:IO241) MX1.H19@IO242(BANK6:IO242) MX1.H20@IO243(BANK6:IO243) MX1.H21@IO244(BANK6:IO244) MX1.H22@IO245(BANK6:IO245) MX1.J1@IO28(BANK1B:IO28) MX1.J3@IO10(BANK1A:IO10) MX1.J4@IO11(BANK1A:IO11) MX1.J8@IO12(BANK1A:IO12) MX1.J9@IO13(BANK1A:IO13) MX1.J10@IO360(BANK8:IO360) MX1.J11@IO322(BANK7:IO322) MX1.J12@IO323(BANK7:IO323) MX1.J13@IO324(BANK7:IO324) MX1.J14@IO246(BANK6:IO246) MX1.J15@IO247(BANK6:IO247) MX1.J18@IO248(BANK6:IO248) MX1.J20@IO249(BANK6:IO249) MX1.J21@IO250(BANK6:IO250) MX1.J22@IO251(BANK6:IO251) MX1.K1@IO29(BANK1B:IO29) MX1.K2@IO30(BANK1B:IO30) MX1.K4@IO14(BANK1A:IO14) MX1.K5@IO15(BANK1A:IO15) MX1.K6@IO16(BANK1A:IO16) MX1.K8@IO31(BANK1B:IO31) MX1.K14@IO252(BANK6:IO252) MX1.K15@IO253(BANK6:IO253) MX1.K18@IO254(BANK6:IO254) MX1.K19@IO255(BANK6:IO255) MX1.K20@IO256(BANK6:IO256) MX1.K21@IO257(BANK6:IO257) MX1.K22@IO258(BANK6:IO258) MX1.L1@IO33(BANK1B:IO33) MX1.L2@IO34(BANK1B:IO34) MX1.L3@DNU(POWER:DNU) MX1.L8@IO36(BANK1B:IO36) MX1.L9@IO37(BANK1B:IO37) MX1.L14@IO259(BANK6:IO259) MX1.L15@IO260(BANK6:IO260) MX1.L18@IO261(BANK6:IO261) MX1.L19@IO262(BANK6:IO262) MX1.L20@IO263(BANK6:IO263) MX1.L22@IO175(BANK5:IO175) MX1.M1@IO41(BANK2:IO41) MX1.M2@IO42(BANK2:IO42) MX1.M3@IO38(BANK1B:IO38) MX1.M4@IO39(BANK1B:IO39) MX1.M8@IO43(BANK2:IO43) MX1.M9@IO44(BANK2:IO44) MX1.M14@IO264(BANK6:IO264) MX1.M15@IO265(BANK6:IO265) MX1.M18@IO266(BANK6:IO266) MX1.M20@IO267(BANK6:IO267) MX1.M21@IO176(BANK5:IO176) MX1.M22@IO177(BANK5:IO177) MX1.N1@IO45(BANK2:IO45) MX1.N2@IO46(BANK2:IO46) MX1.N3@IO47(BANK2:IO47) MX1.N4@IO48(BANK2:IO48) MX1.N5@IO49(BANK2:IO49) MX1.N8@IO50(BANK2:IO50) MX1.N9@IO51(BANK2:IO51) MX1.N14@IO268(BANK6:IO268) MX1.N15@IO269(BANK6:IO269) MX1.N18@IO270(BANK6:IO270) MX1.N19@IO271(BANK6:IO271) MX1.N20@IO272(BANK6:IO272) MX1.N21@IO178(BANK5:IO178) MX1.N22@IO179(BANK5:IO179) MX1.P1@IO52(BANK2:IO52) MX1.P3@IO53(BANK2:IO53) MX1.P4@IO54(BANK2:IO54) MX1.P5@IO55(BANK2:IO55) MX1.P8@IO56(BANK2:IO56) MX1.P9@IO96(BANK3:IO96) MX1.P10@IO94(BANK3:IO94) MX1.P11@IO95(BANK3:IO95) MX1.P12@IO146(BANK4:IO146) MX1.P13@IO147(BANK4:IO147) MX1.P14@IO180(BANK5:IO180) MX1.P15@IO181(BANK5:IO181) MX1.P18@IO182(BANK5:IO182) MX1.P19@IO183(BANK5:IO183) MX1.P20@IO184(BANK5:IO184) MX1.P21@IO185(BANK5:IO185) MX1.P22@IO186(BANK5:IO186) MX1.R1@IO57(BANK2:IO57) MX1.R2@IO58(BANK2:IO58) MX1.R3@IO59(BANK2:IO59) MX1.R4@IO60(BANK2:IO60) MX1.R5@IO61(BANK2:IO61) MX1.R7@IO62(BANK2:IO62) MX1.R9@IO99(BANK3:IO99) MX1.R10@IO97(BANK3:IO97) MX1.R11@IO98(BANK3:IO98) MX1.R12@IO148(BANK4:IO148) MX1.R13@IO149(BANK4:IO149) MX1.R14@IO187(BANK5:IO187) MX1.R15@IO188(BANK5:IO188) MX1.R18@IO189(BANK5:IO189) MX1.R20@IO190(BANK5:IO190) MX1.R22@IO191(BANK5:IO191) MX1.T1@IO63(BANK2:IO63) MX1.T2@IO64(BANK2:IO64) MX1.T3@IO65(BANK2:IO65) MX1.T5@IO66(BANK2:IO66) MX1.T6@IO67(BANK2:IO67) MX1.T18@IO192(BANK5:IO192) MX1.T19@IO193(BANK5:IO193) MX1.T20@IO194(BANK5:IO194) MX1.T21@IO195(BANK5:IO195) MX1.T22@IO196(BANK5:IO196) MX1.U1@IO68(BANK2:IO68) MX1.U2@IO69(BANK2:IO69) MX1.U3@IO70(BANK2:IO70) MX1.U4@IO71(BANK2:IO71) MX1.U5@IO72(BANK2:IO72) MX1.U6@IO100(BANK3:IO100) MX1.U7@IO101(BANK3:IO101) MX1.U15@IO150(BANK4:IO150) MX1.U17@IO197(BANK5:IO197) MX1.U18@IO198(BANK5:IO198) MX1.U19@IO199(BANK5:IO199) MX1.U20@IO200(BANK5:IO200) MX1.V1@IO73(BANK2:IO73) MX1.V3@IO74(BANK2:IO74) MX1.V4@IO103(BANK3:IO103) MX1.V5@IO104(BANK3:IO104) MX1.V7@IO105(BANK3:IO105) MX1.V8@IO106(BANK3:IO106) MX1.V10@IO102(BANK3:IO102) MX1.V11@IO151(BANK4:IO151) MX1.W1@IO75(BANK2:IO75) MX1.Y1@IO116(BANK3:IO116) MX1.Y13@IO167(BANK4:IO167) MX1.Y14@IO168(BANK4:IO168) MX1.Y16@IO169(BANK4:IO169)

## Buses
DBUS:IO[17..360]

## Notes on the sheet
- INPOW GND
- TCK
- TDO
- TMS
- TDI
- IO356 | nStatus
- IO355 | CONFDONE
- IO359 | nConfig
- IO348 | DEV_CLRn
- JTAG_EN/IO32
- IO281
- IO283
- IO213
- IO215
- IO216
- IO219
- IO223
- IO229

## Library data of the parts
C1-C16 = rcl:C-EU: CAPACITOR, European symbol
ENPI1V2 ENPI2V5 = enpirion:ENPIRION: EN5311QI 1A PowerSoC
INPOW INPOW2 = pinhead:PINHD-1X2: PIN HEADER
ISSI1(A) ISSI2(B) = issi:ISSIDEV: ISSI SRAM
JTAGHEADER = pinhead:PINHD-2X5: PIN HEADER
LED1-LED4 = led:LED: LED OSRAM: - CHIPLED LG R971, LG N971, LY N971, LG Q971, LY Q971, LO R971, LY R971 LH N974, LH R974 LS Q976, LO Q976, LY Q976 LO Q996 - Hyper CHIPLED LW Q18S LB Q993, LB Q99A, LB R99A - SideLED LS A670, LO A670, LY A670, LG A670, LP A670 LB A673, LV A673, LT A673, LW A673 LH A674 LY A675 LS A676, LA A676, LO A676, LY A676, LW A676 LS A679, LY A679, LG A679 - Hyper Micro SIDELED® LS Y876, LA Y876, LO Y876, LY Y876 LT Y87S - SmartLED LW L88C, LW L88S LB L89C, LB L89S, LG L890 LS L89K, LO L89K, LY L89K LS L896, LA L896, LO L896, LY L896 - TOPLED LS T670, LO T670, LY T670, LG T670, LP T670 LSG T670, LSP T670, LSY T670, LOP T670, LYG T670 LG T671, LOG T671, LSG T671 LB T673, LV T673, LT T673, LW T673 LH T674 LS T676, LA T676, LO T676, LY T676, LB T676, LH T676, LSB T676, LW T676 LB T67C, LV T67C, LT T67C, LS T67K, LO T67K, LY T67K, LW E67C LS E67B, LA E67B, LO E67B, LY E67B, LB E67C, LV E67C, LT E67C LW T67C LS T679, LY T679, LG T679 LS T770, LO T770, LY T770, LG T770, LP T770 LB T773, LV T773, LT T773, LW T773 LH T774 LS E675, LA E675, LY E675, LS T675 LS T776, LA T776, LO T776, LY T776, LB T776 LHGB T686 LT T68C, LB T68C - Hyper Mini TOPLED® LB M676 - Mini TOPLED Santana® LG M470 LS M47K, LO M47K, LY M47K Source: http://www.osram.convergy.de LUXEON: - LUMILED® LXK2-PW12-R00, LXK2-PW12-S00, LXK2-PW14-U00, LXK2-PW14-V00 LXK2-PM12-R00, LXK2-PM12-S00, LXK2-PM14-U00 LXK2-PE12-Q00, LXK2-PE12-R00, LXK2-PE12-S00, LXK2-PE14-T00, LXK2-PE14-U00 LXK2-PB12-K00, LXK2-PB12-L00, LXK2-PB12-M00, LXK2-PB14-N00, LXK2-PB14-P00, LXK2-PB14-Q00 LXK2-PR12-L00, LXK2-PR12-M00, LXK2-PR14-Q00, LXK2-PR14-R00 LXK2-PD12-Q00, LXK2-PD12-R00, LXK2-PD12-S00 LXK2-PH12-R00, LXK2-PH12-S00 LXK2-PL12-P00, LXK2-PL12-Q00, LXK2-PL12-R00 Source: www.luxeon.com KINGBRIGHT: KA-3528ASYC Source: www.kingbright.com
MX1 = max10:MX: MAX 10 484-Pin FineLine Ball-Grid Array
R1-R24 SW.6- SW.9- SW.10- SW.14+ SW.15- SW.16+ = rcl:R-EU_: RESISTOR, European symbol

## Net classes
1 sup: width 0.508 mm